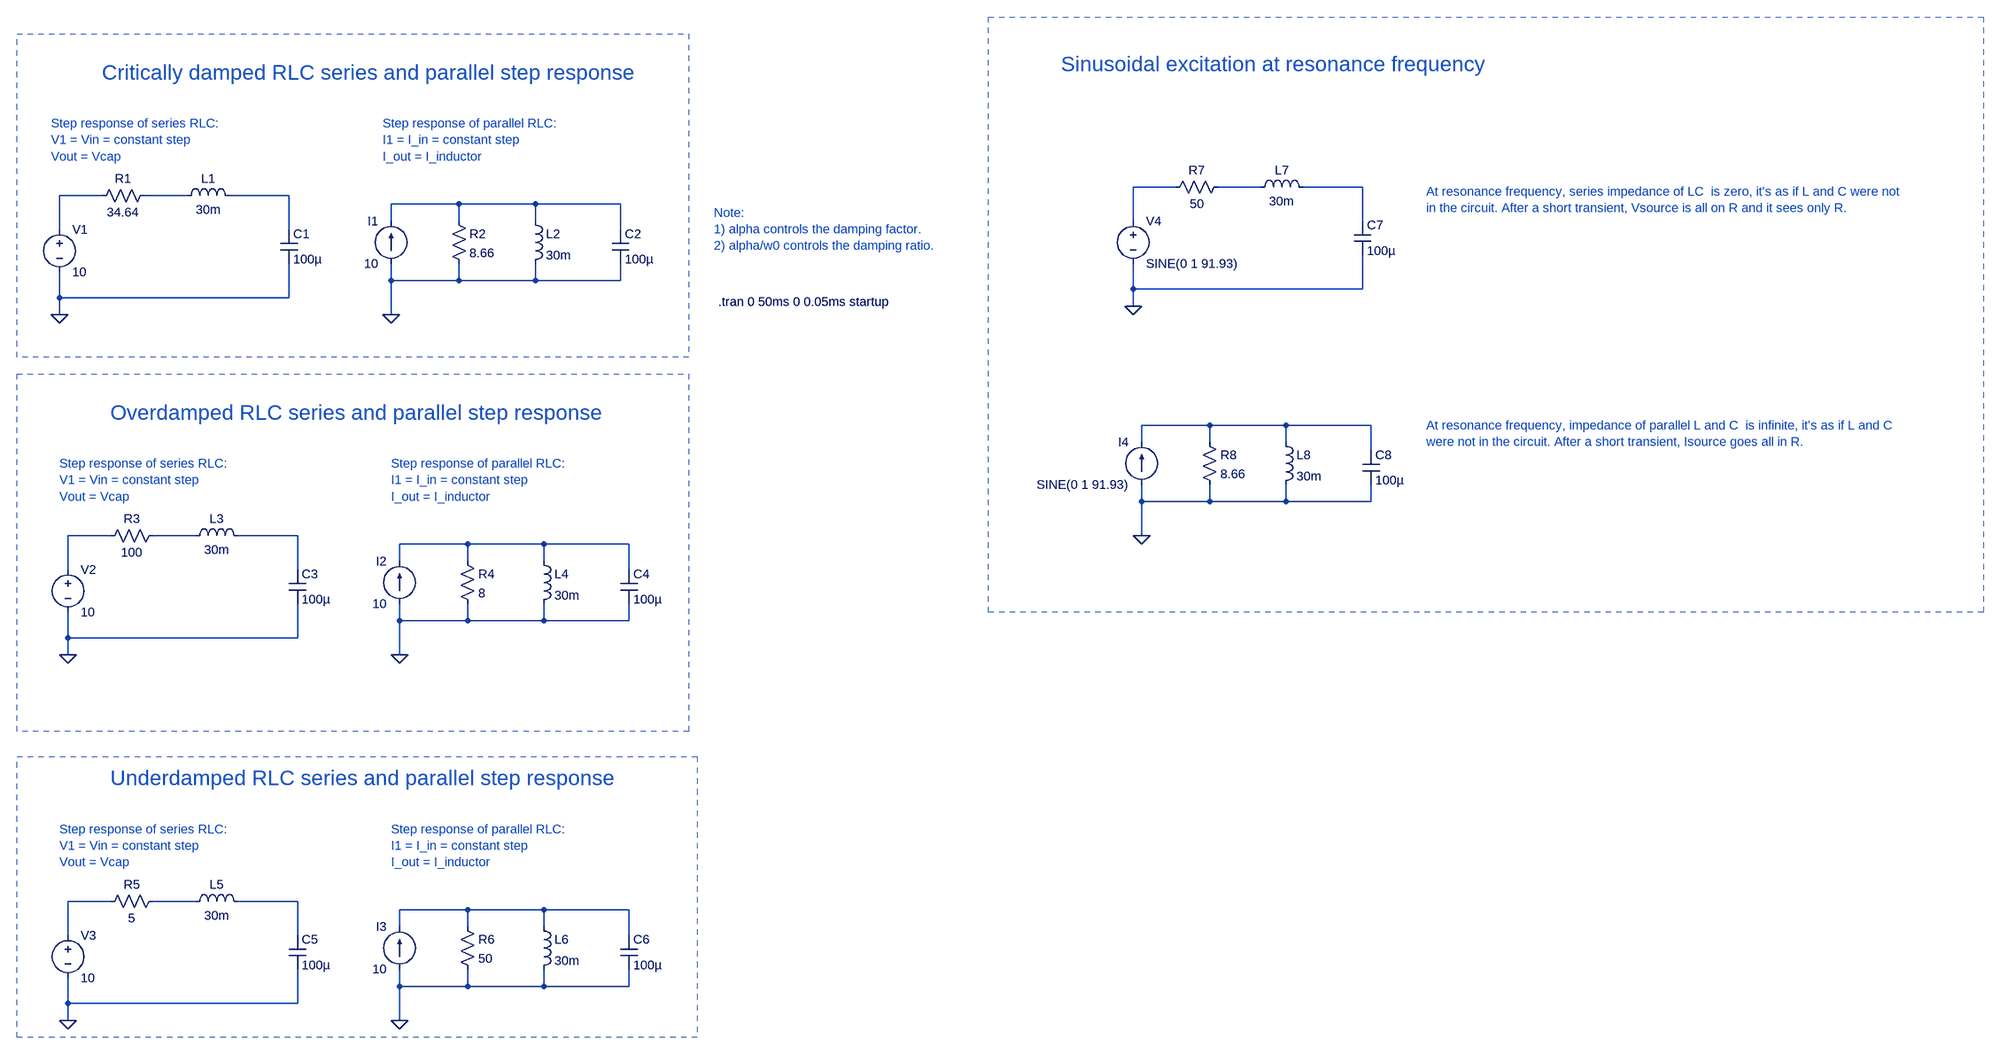
[diagram p0: schematic RLC-step-response-resonance-frequency-series-parallel.asc]
RLC-step-response-resonance-frequency-series-parallel.asc, the LTspice schematic file:
Version 4
SHEET 1 3524 1744
WIRE 2000 96 1920 96
WIRE 2160 96 2080 96
WIRE 2352 96 2240 96
WIRE -64 112 -144 112
WIRE 96 112 16 112
WIRE 288 112 176 112
WIRE 608 128 480 128
WIRE 752 128 608 128
WIRE 912 128 752 128
WIRE 480 160 480 128
WIRE 608 160 608 128
WIRE 752 160 752 128
WIRE 1920 160 1920 96
WIRE 2352 160 2352 96
WIRE -144 176 -144 112
WIRE 288 176 288 112
WIRE 912 176 912 128
WIRE 480 272 480 240
WIRE 608 272 608 240
WIRE 608 272 480 272
WIRE 752 272 752 240
WIRE 752 272 608 272
WIRE 912 272 912 240
WIRE 912 272 752 272
WIRE 1920 288 1920 240
WIRE 2352 288 2352 224
WIRE 2352 288 1920 288
WIRE -144 304 -144 256
WIRE 288 304 288 240
WIRE 288 304 -144 304
WIRE 1920 320 1920 288
WIRE -144 336 -144 304
WIRE 480 336 480 272
WIRE 2064 544 1936 544
WIRE 2208 544 2064 544
WIRE 2368 544 2208 544
WIRE 1936 576 1936 544
WIRE 2064 576 2064 544
WIRE 2208 576 2208 544
WIRE 2368 592 2368 544
WIRE 1936 688 1936 656
WIRE 2064 688 2064 656
WIRE 2064 688 1936 688
WIRE 2208 688 2208 656
WIRE 2208 688 2064 688
WIRE 2368 688 2368 656
WIRE 2368 688 2208 688
WIRE -48 752 -128 752
WIRE 112 752 32 752
WIRE 304 752 192 752
WIRE 1936 752 1936 688
WIRE 624 768 496 768
WIRE 768 768 624 768
WIRE 928 768 768 768
WIRE 496 800 496 768
WIRE 624 800 624 768
WIRE 768 800 768 768
WIRE -128 816 -128 752
WIRE 304 816 304 752
WIRE 928 816 928 768
WIRE 496 912 496 880
WIRE 624 912 624 880
WIRE 624 912 496 912
WIRE 768 912 768 880
WIRE 768 912 624 912
WIRE 928 912 928 880
WIRE 928 912 768 912
WIRE -128 944 -128 896
WIRE 304 944 304 880
WIRE 304 944 -128 944
WIRE -128 976 -128 944
WIRE 496 976 496 912
WIRE -48 1440 -128 1440
WIRE 112 1440 32 1440
WIRE 304 1440 192 1440
WIRE 624 1456 496 1456
WIRE 768 1456 624 1456
WIRE 928 1456 768 1456
WIRE 496 1488 496 1456
WIRE 624 1488 624 1456
WIRE 768 1488 768 1456
WIRE -128 1504 -128 1440
WIRE 304 1504 304 1440
WIRE 928 1504 928 1456
WIRE 496 1600 496 1568
WIRE 624 1600 624 1568
WIRE 624 1600 496 1600
WIRE 768 1600 768 1568
WIRE 768 1600 624 1600
WIRE 928 1600 928 1568
WIRE 928 1600 768 1600
WIRE -128 1632 -128 1584
WIRE 304 1632 304 1568
WIRE 304 1632 -128 1632
WIRE -128 1664 -128 1632
WIRE 496 1664 496 1600
FLAG -144 336 0
FLAG 480 336 0
FLAG -128 976 0
FLAG 496 976 0
FLAG -128 1664 0
FLAG 496 1664 0
FLAG 1920 320 0
FLAG 1936 752 0
SYMBOL voltage -144 160 R0
WINDOW 123 0 0 Left 2
WINDOW 39 0 0 Left 2
SYMATTR InstName V1
SYMATTR Value 10
SYMBOL ind 80 128 R270
WINDOW 0 32 56 VTop 2
WINDOW 3 5 56 VBottom 2
SYMATTR InstName L1
SYMATTR Value 30m
SYMBOL res -80 128 R270
WINDOW 0 32 56 VTop 2
WINDOW 3 0 56 VBottom 2
SYMATTR InstName R1
SYMATTR Value 34.64
SYMBOL cap 272 176 R0
SYMATTR InstName C1
SYMATTR Value 100µ
SYMBOL ind 736 144 R0
SYMATTR InstName L2
SYMATTR Value 30m
SYMBOL res 592 144 R0
SYMATTR InstName R2
SYMATTR Value 8.66
SYMBOL cap 896 176 R0
SYMATTR InstName C2
SYMATTR Value 100µ
SYMBOL current 480 240 R180
WINDOW 0 24 80 Left 2
WINDOW 3 24 0 Left 2
WINDOW 123 0 0 Left 0
WINDOW 39 0 0 Left 0
SYMATTR InstName I1
SYMATTR Value 10
SYMBOL voltage -128 800 R0
WINDOW 123 0 0 Left 2
WINDOW 39 0 0 Left 2
SYMATTR InstName V2
SYMATTR Value 10
SYMBOL ind 96 768 R270
WINDOW 0 32 56 VTop 2
WINDOW 3 5 56 VBottom 2
SYMATTR InstName L3
SYMATTR Value 30m
SYMBOL res -64 768 R270
WINDOW 0 32 56 VTop 2
WINDOW 3 0 56 VBottom 2
SYMATTR InstName R3
SYMATTR Value 100
SYMBOL cap 288 816 R0
SYMATTR InstName C3
SYMATTR Value 100µ
SYMBOL ind 752 784 R0
SYMATTR InstName L4
SYMATTR Value 30m
SYMBOL res 608 784 R0
SYMATTR InstName R4
SYMATTR Value 8
SYMBOL cap 912 816 R0
SYMATTR InstName C4
SYMATTR Value 100µ
SYMBOL current 496 880 R180
WINDOW 0 24 80 Left 2
WINDOW 3 24 0 Left 2
WINDOW 123 0 0 Left 0
WINDOW 39 0 0 Left 0
SYMATTR InstName I2
SYMATTR Value 10
SYMBOL voltage -128 1488 R0
WINDOW 123 0 0 Left 2
WINDOW 39 0 0 Left 2
SYMATTR InstName V3
SYMATTR Value 10
SYMBOL ind 96 1456 R270
WINDOW 0 32 56 VTop 2
WINDOW 3 5 56 VBottom 2
SYMATTR InstName L5
SYMATTR Value 30m
SYMBOL res -64 1456 R270
WINDOW 0 32 56 VTop 2
WINDOW 3 0 56 VBottom 2
SYMATTR InstName R5
SYMATTR Value 5
SYMBOL cap 288 1504 R0
SYMATTR InstName C5
SYMATTR Value 100µ
SYMBOL ind 752 1472 R0
SYMATTR InstName L6
SYMATTR Value 30m
SYMBOL res 608 1472 R0
SYMATTR InstName R6
SYMATTR Value 50
SYMBOL cap 912 1504 R0
SYMATTR InstName C6
SYMATTR Value 100µ
SYMBOL current 496 1568 R180
WINDOW 0 24 80 Left 2
WINDOW 3 24 0 Left 2
WINDOW 123 0 0 Left 0
WINDOW 39 0 0 Left 0
SYMATTR InstName I3
SYMATTR Value 10
SYMBOL voltage 1920 144 R0
WINDOW 123 0 0 Left 2
WINDOW 39 0 0 Left 2
SYMATTR InstName V4
SYMATTR Value SINE(0 1 91.93)
SYMBOL ind 2144 112 R270
WINDOW 0 32 56 VTop 2
WINDOW 3 5 56 VBottom 2
SYMATTR InstName L7
SYMATTR Value 30m
SYMBOL res 1984 112 R270
WINDOW 0 32 56 VTop 2
WINDOW 3 0 56 VBottom 2
SYMATTR InstName R7
SYMATTR Value 50
SYMBOL cap 2336 160 R0
SYMATTR InstName C7
SYMATTR Value 100µ
SYMBOL ind 2192 560 R0
SYMATTR InstName L8
SYMATTR Value 30m
SYMBOL res 2048 560 R0
SYMATTR InstName R8
SYMATTR Value 8.66
SYMBOL cap 2352 592 R0
SYMATTR InstName C8
SYMATTR Value 100µ
SYMBOL current 1936 656 R180
WINDOW 0 24 80 Left 2
WINDOW 3 24 0 Left 2
WINDOW 123 0 0 Left 0
WINDOW 39 0 0 Left 0
SYMATTR InstName I4
SYMATTR Value SINE(0 1 91.93)
TEXT 1096 312 Left 2 !.tran 0 50ms 0 0.05ms startup
TEXT -160 -24 Left 2 ;Step response of series RLC:\nV1 = Vin = constant step\nVout = Vcap
TEXT 464 -24 Left 2 ;Step response of parallel RLC:\nI1 = I_in = constant step\nI_out = I_inductor
TEXT -64 -120 Left 4 ;Critically damped RLC series and parallel step response
TEXT 1088 144 Left 2 ;Note:\n1) alpha controls the damping factor.\n2) alpha/w0 controls the damping ratio.
TEXT -144 616 Left 2 ;Step response of series RLC:\nV1 = Vin = constant step\nVout = Vcap
TEXT 480 616 Left 2 ;Step response of parallel RLC:\nI1 = I_in = constant step\nI_out = I_inductor
TEXT -48 520 Left 4 ;Overdamped RLC series and parallel step response
TEXT -144 1304 Left 2 ;Step response of series RLC:\nV1 = Vin = constant step\nVout = Vcap
TEXT 480 1304 Left 2 ;Step response of parallel RLC:\nI1 = I_in = constant step\nI_out = I_inductor
TEXT -48 1208 Left 4 ;Underdamped RLC series and parallel step response
TEXT 1784 -136 Left 4 ;Sinusoidal excitation at resonance frequency
TEXT 2472 104 Left 2 ;At resonance frequency, series impedance of LC  is zero, it's as if L and C were not\nin the circuit. After a short transient, Vsource is all on R and it sees only R.
TEXT 2472 544 Left 2 ;At resonance frequency, impedance of parallel L and C  is infinite, it's as if L and C \nwere not in the circuit. After a short transient, Isource goes all in R.
RECTANGLE Normal 1040 416 -224 -192 2
RECTANGLE Normal 1040 1120 -224 448 2
RECTANGLE Normal 1056 1696 -224 1168 2
RECTANGLE Normal 3520 896 1648 -224 2

The netlist it stands for:
* RLC-step-response-resonance-frequency-series-parallel.asc
V1 N004 0 10
L1 N005 N006 30m
R1 N004 N005 34.64
C1 N006 0 100µ
L2 N007 0 30m
R2 N007 0 8.66
C2 N007 0 100µ
I1 0 N007 10
V2 N009 0 10
L3 N010 N011 30m
R3 N009 N010 100
C3 N011 0 100µ
L4 N012 0 30m
R4 N012 0 8
C4 N012 0 100µ
I2 0 N012 10
V3 N013 0 10
L5 N014 N015 30m
R5 N013 N014 5
C5 N015 0 100µ
L6 N016 0 30m
R6 N016 0 50
C6 N016 0 100µ
I3 0 N016 10
V4 N001 0 SINE(0 1 91.93)
L7 N002 N003 30m
R7 N001 N002 50
C7 N003 0 100µ
L8 N008 0 30m
R8 N008 0 8.66
C8 N008 0 100µ
I4 0 N008 SINE(0 1 91.93)
.tran 0 50ms 0 0.05ms startup
* Step response of series RLC:
* V1 = Vin = constant step
* Vout = Vcap
* Step response of parallel RLC:
* I1 = I_in = constant step
* I_out = I_inductor
* Critically damped RLC series and parallel step response
* Note:
* 1) alpha controls the damping factor.
* 2) alpha/w0 controls the damping ratio.
* Step response of series RLC:
* V1 = Vin = constant step
* Vout = Vcap
* Step response of parallel RLC:
* I1 = I_in = constant step
* I_out = I_inductor
* Overdamped RLC series and parallel step response
* Step response of series RLC:
* V1 = Vin = constant step
* Vout = Vcap
* Step response of parallel RLC:
* I1 = I_in = constant step
* I_out = I_inductor
* Underdamped RLC series and parallel step response
* Sinusoidal excitation at resonance frequency
* At resonance frequency, series impedance of LC  is zero, it's as if L and C were not
* in the circuit. After a short transient, Vsource is all on R and it sees only R.
* At resonance frequency, impedance of parallel L and C  is infinite, it's as if L and C
* were not in the circuit. After a short transient, Isource goes all in R.
.backanno
.end